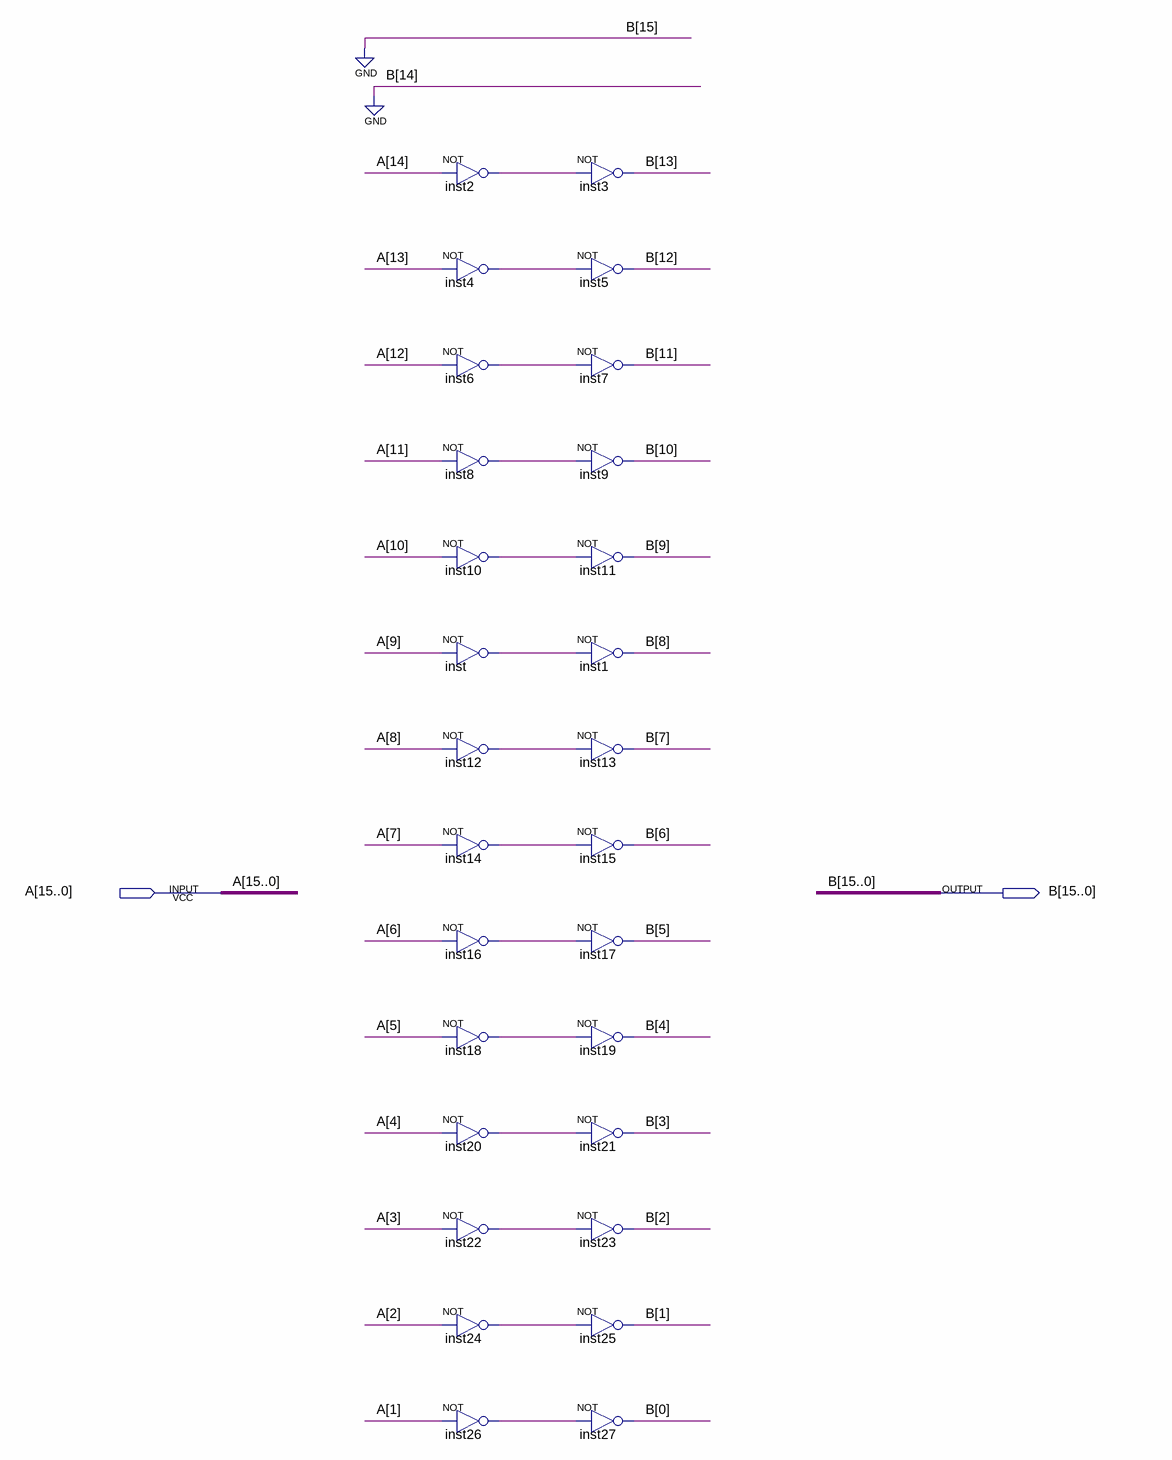
[diagram p0: schematic sheet]
// Quartus schematic shr2.bdf as structural Verilog: 28 symbols, 2 pins
module shr2 (
  input  [15:0] A,
  output [15:0] B
);

  wire inst2_out, inst4_out, inst6_out, inst8_out, inst10_out, inst12_out, inst14_out, inst16_out,
       inst18_out, inst20_out, inst22_out, inst24_out, inst26_out, inst_out;

  not inst2 (inst2_out, A[14]);
  not inst4 (inst4_out, A[13]);
  not inst6 (inst6_out, A[12]);
  not inst8 (inst8_out, A[11]);
  not inst10 (inst10_out, A[10]);
  not inst (inst_out, A[9]);
  not inst12 (inst12_out, A[8]);
  not inst14 (inst14_out, A[7]);
  not inst16 (inst16_out, A[6]);
  not inst18 (inst18_out, A[5]);
  not inst20 (inst20_out, A[4]);
  not inst22 (inst22_out, A[3]);
  not inst24 (inst24_out, A[2]);
  not inst26 (inst26_out, A[1]);
  not inst3 (B[13], inst2_out);
  not inst5 (B[12], inst4_out);
  not inst7 (B[11], inst6_out);
  not inst9 (B[10], inst8_out);
  not inst11 (B[9], inst10_out);
  not inst1 (B[8], inst_out);
  not inst13 (B[7], inst12_out);
  not inst15 (B[6], inst14_out);
  not inst17 (B[5], inst16_out);
  not inst19 (B[4], inst18_out);
  not inst21 (B[3], inst20_out);
  not inst23 (B[2], inst22_out);
  not inst25 (B[1], inst24_out);
  not inst27 (B[0], inst26_out);

  assign B[15:14] = 2'b00;
endmodule
